# EAGLE design led_dual_supply_REV_2 (EAGLE 5.07)
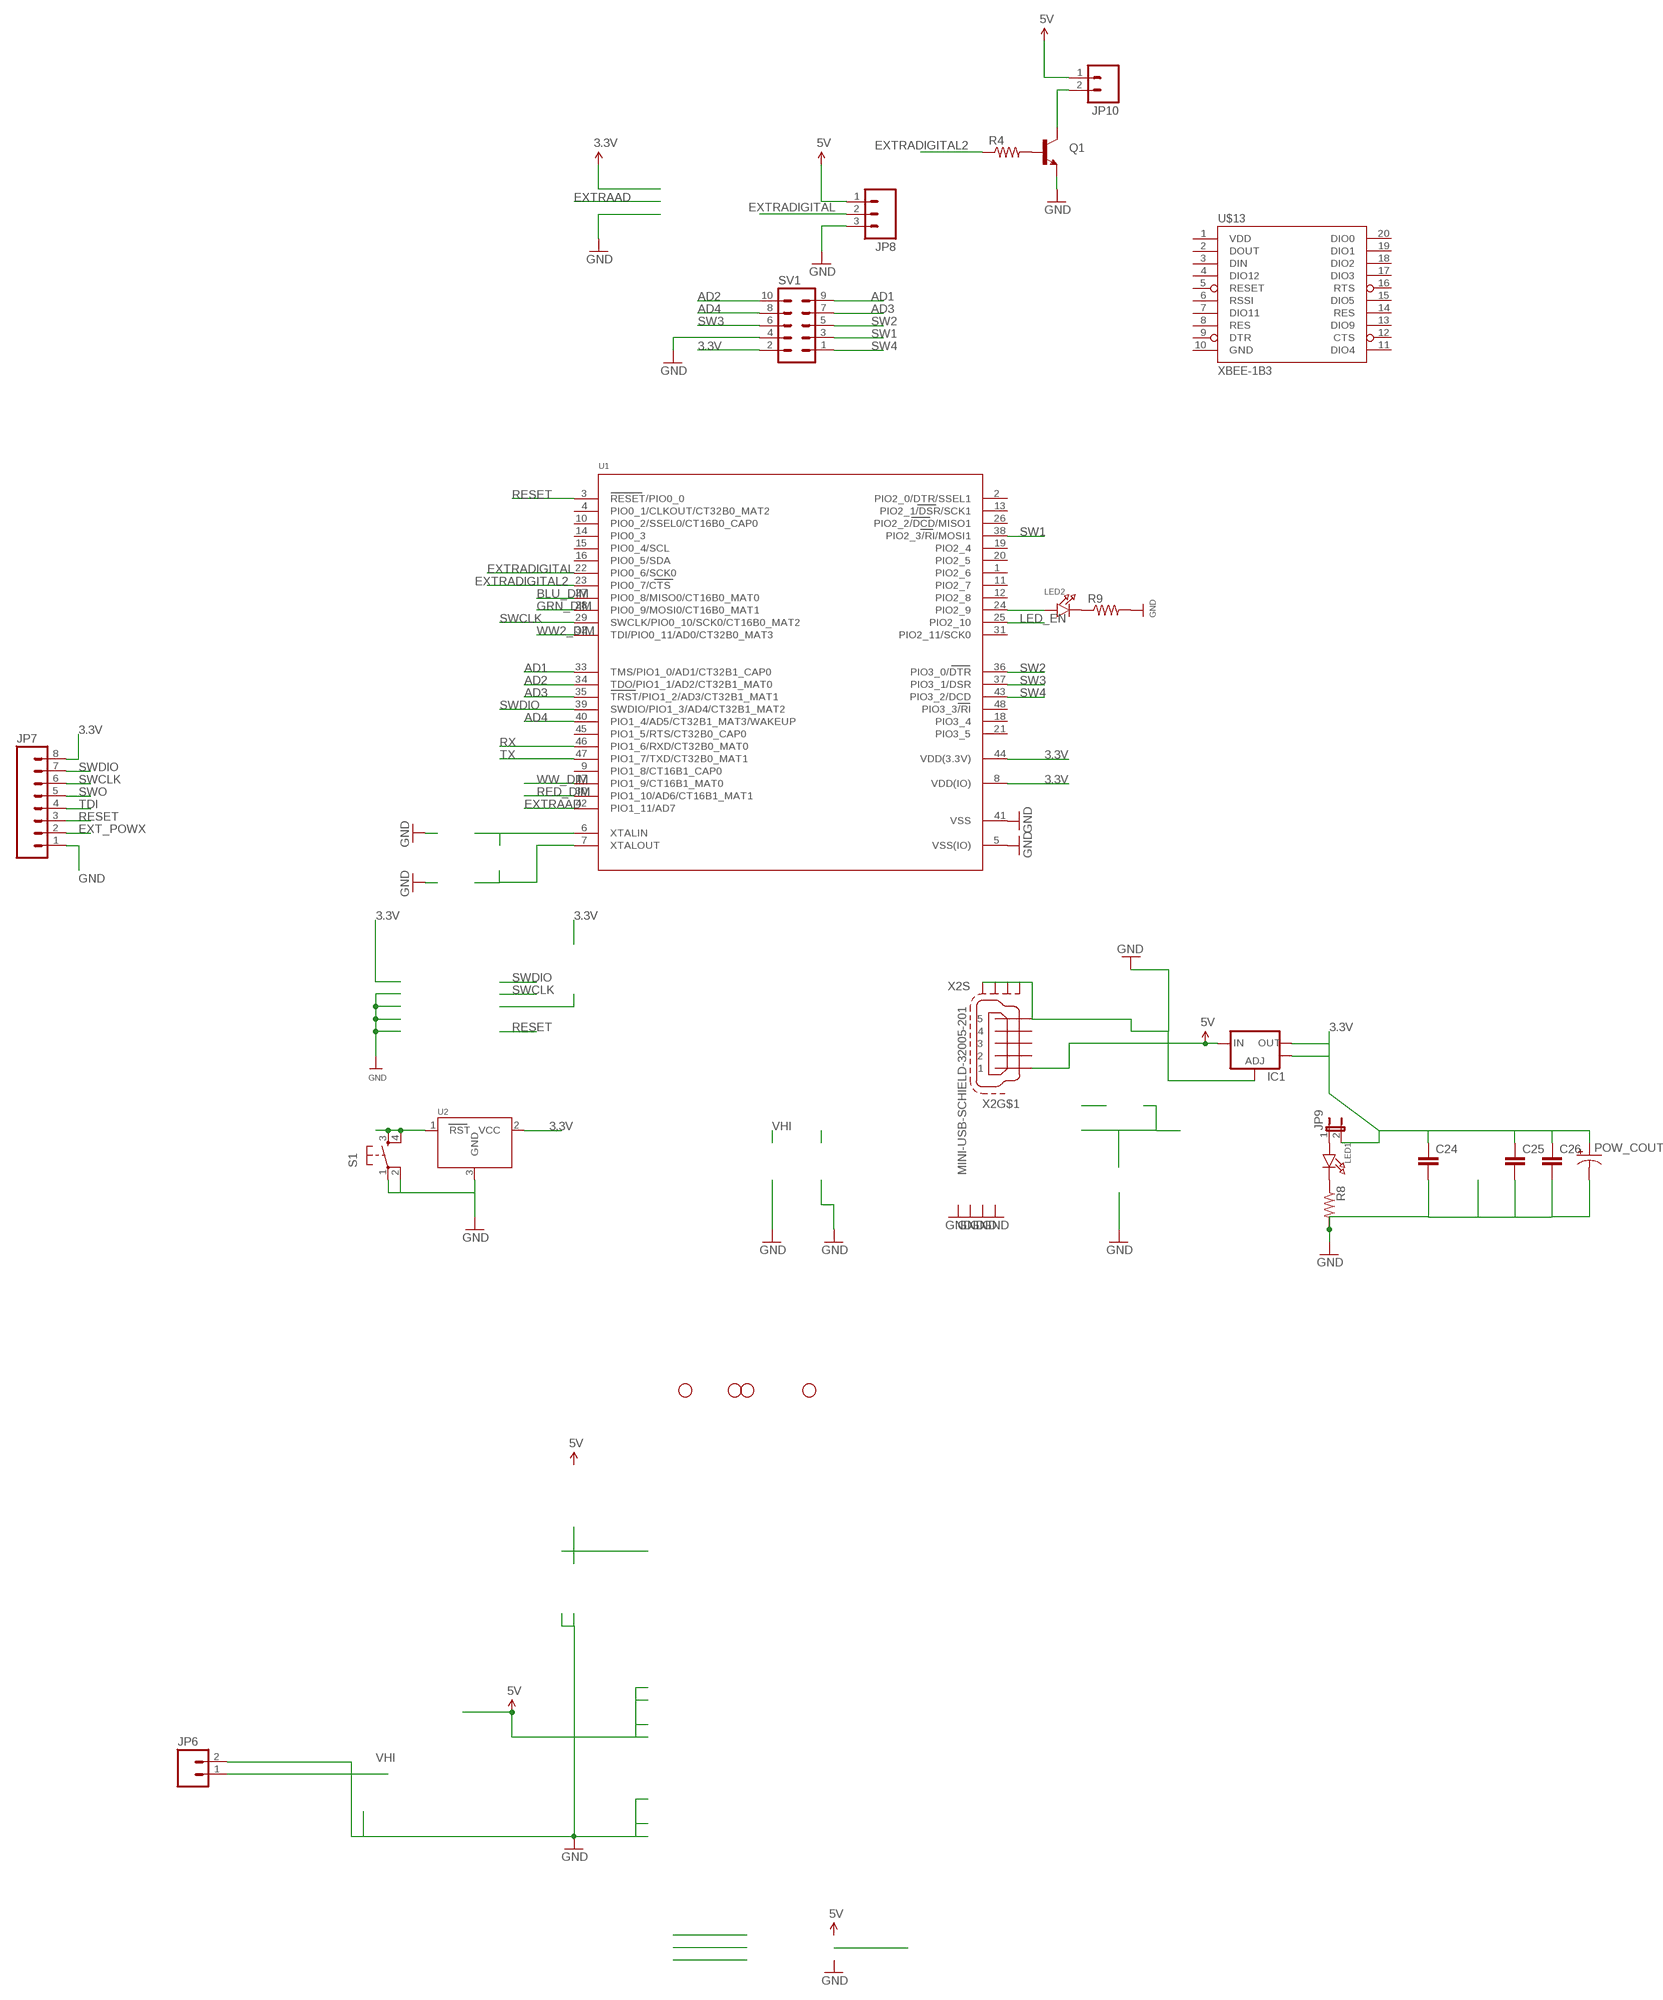
[diagram p0: schematic, sheet 1, part 1 of 2]
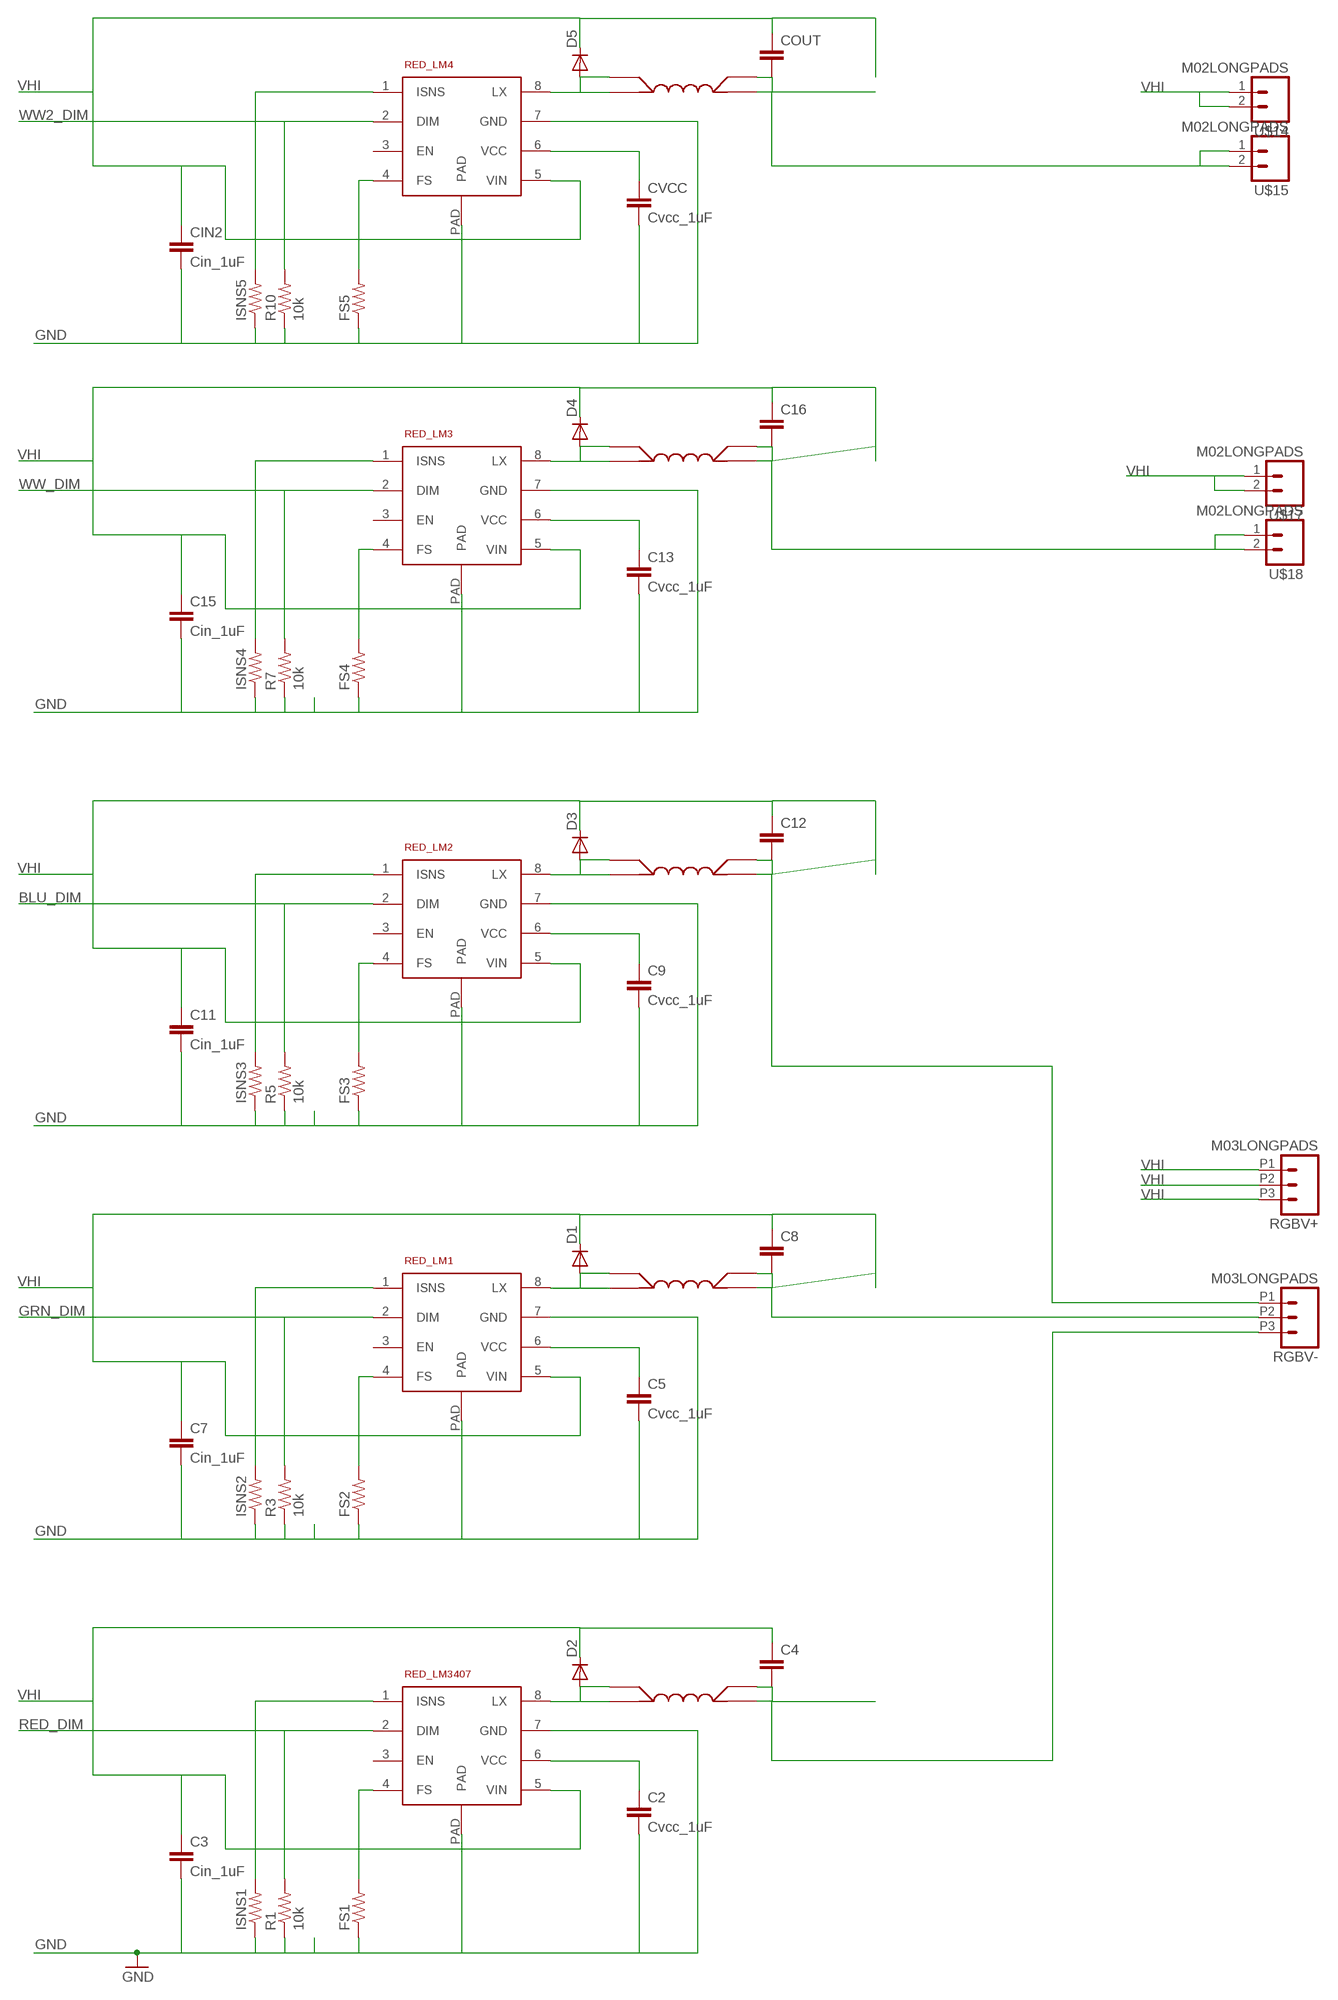
[diagram p1: schematic, sheet 1, part 2 of 2]

## Parts
C2  Cvcc_1uF  C-EUC1206  [C1206]
C3  Cin_1uF  C-EUC1206  [C1206]
C4  C-EUC1206  [C1206]
C5  Cvcc_1uF  C-EUC1206  [C1206]
C7  Cin_1uF  C-EUC1206  [C1206]
C8  C-EUC1206  [C1206]
C9  Cvcc_1uF  C-EUC1206  [C1206]
C11  Cin_1uF  C-EUC1206  [C1206]
C12  C-EUC1206  [C1206]
C13  Cvcc_1uF  C-EUC1206  [C1206]
C15  Cin_1uF  C-EUC1206  [C1206]
C16  C-EUC1206  [C1206]
C24  CAP0805  [0805]
C25  CAP0805  [0805]
C26  CAP0805  [0805]
CIN2  Cin_1uF  C-EUC1206  [C1206]
COUT  C-EUC1206  [C1206]
CVCC  Cvcc_1uF  C-EUC1206  [C1206]
D1  DIODESMA  [SMA-DIODE]
D2  DIODESMA  [SMA-DIODE]
D3  DIODESMA  [SMA-DIODE]
D4  DIODESMA  [SMA-DIODE]
D5  DIODESMA  [SMA-DIODE]
FS1  RESISTOR  [0805]
FS2  RESISTOR  [0805]
FS3  RESISTOR  [0805]
FS4  RESISTOR  [0805]
FS5  RESISTOR  [0805]
IC1  V_REG_LM1117SOT223  [SOT223]
ISNS1  RESISTOR  [0805]
ISNS2  RESISTOR  [0805]
ISNS3  RESISTOR  [0805]
ISNS4  RESISTOR  [0805]
ISNS5  RESISTOR  [0805]
JP2  STAND-OFF  [STAND-OFF]
JP3  STAND-OFF  [STAND-OFF]
JP4  STAND-OFF  [STAND-OFF]
JP5  STAND-OFF  [STAND-OFF]
JP6  M02  [1X02_LONGPADS]
JP7  M08  [1X08]
JP8  M03LOCK_LONGPADS  [1X03_LOCK_LONGPADS]
JP9  JUMPER-2SMD-NC  [SJ_2S]
JP10  M02LOCK  [1X02_LOCK]
LED1  LED0805  [CHIPLED_0805]
LED2  LED0805  [CHIPLED_0805]
POW_COUT  CAP_POL7343  [EIA7343]
Q1  TRANSISTOR_NPNSOT23-3  [SOT23-3]
R1  10k  RESISTOR  [0805]
R3  10k  RESISTOR  [0805]
R4  RESISTOR  [0805]
R5  10k  RESISTOR  [0805]
R7  10k  RESISTOR  [0805]
R8  RESISTOR  [0805]
R9  RESISTOR  [0805]
R10  10k  RESISTOR  [0805]
RED_LM1  LM3407  [LM3407]
RED_LM2  LM3407  [LM3407]
RED_LM3  LM3407  [LM3407]
RED_LM4  LM3407  [LM3407]
RED_LM3407  LM3407  [LM3407]
RGBV+  M03LONGPADS  [A19430-ELON]
RGBV-  M03LONGPADS  [A19430-ELON]
S1  TAC_SWITCHPTH  [TACTILE-PTH]
SV1  ML10  [ML10]
U1  LPC1113/4  [LQFP48]
U2  MCP130TREFLOW  [SOT23-R]
U$1  SRR4018  [SDR0805]
U$2  SRR4018  [SDR0805]
U$3  SRR4018  [SDR0805]
U$4  SRR4018  [SDR0805]
U$11  SRR4018  [SDR0805]
U$13  XBEE-1B3  [XBEE-SMD]
U$14  M02LONGPADS  [A19423-ELON]
U$15  M02LONGPADS  [A19423-ELON]
U$17  M02LONGPADS  [A19423-ELON]
U$18  M02LONGPADS  [A19423-ELON]
X2  MINI-USB-SCHIELD-32005-201  [32005-201]

## Nets
3.3V: C24.1 C25.1 C26.1 IC1.2(OUT) IC1.4(OUT) JP7.8 JP9.2 POW_COUT.A(+) SV1.2 U1.8(VDD(IO)) U1.44(VDD(3.3V)) U2.2(VCC) ; supply symbol labelled 5V
5V: IC1.3(IN) JP8.1 JP10.1 X2.1
AD1: SV1.9 U1.33(TMS/PIO1_0/AD1/CT32B1_CAP0)
AD2: SV1.10 U1.34(TDO/PIO1_1/AD2/CT32B1_MAT0)
AD3: SV1.7 U1.35(TRST/PIO1_2/AD3/CT32B1_MAT1)
AD4: SV1.8 U1.40(PIO1_4/AD5/CT32B1_MAT3/WAKEUP)
BLU_DIM: R5.2 RED_LM2.2(DIM) U1.27(PIO0_8/MISO0/CT16B0_MAT0)
EXT_POWX: JP7.2
EXTRAAD: U1.42(PIO1_11/AD7)
EXTRADIGITAL: JP8.2 U1.22(PIO0_6/SCK0)
EXTRADIGITAL2: R4.1 U1.23(PIO0_7/CTS)
GND: C2.2 C3.2 C5.2 C7.2 C9.2 C11.2 C13.2 C15.2 C24.2 C25.2 C26.2 CIN2.2 CVCC.2 FS1.1 FS2.1 FS3.1 FS4.1 FS5.1 IC1.1(ADJ) ISNS1.1 ISNS2.1 ISNS3.1 ISNS4.1 ISNS5.1 JP6.2 JP7.1 JP8.3 POW_COUT.C(-) Q1.2(E) R1.1 R3.1 R5.1 R7.1 R8.2 R9.2 R10.1 RED_LM1.7(GND) RED_LM1.PAD RED_LM2.7(GND) RED_LM2.PAD RED_LM3.7(GND) RED_LM3.PAD RED_LM4.7(GND) RED_LM4.PAD RED_LM3407.7(GND) RED_LM3407.PAD S1.1 S1.2 SV1.4 U1.5(VSS(IO)) U1.41(VSS) U2.3(GND) X2.5 X2.M1(S:S1) X2.M2(S:S2) X2.M3(S:S3) X2.M4(S:S4)
GRN_DIM: R3.2 RED_LM1.2(DIM) U1.28(PIO0_9/MOSI0/CT16B0_MAT1)
LED_EN: U1.25(PIO2_10)
N$1: C5.1 RED_LM1.6(VCC)
N$2: FS2.2 RED_LM1.4(FS)
N$3: C2.1 RED_LM3407.6(VCC)
N$4: ISNS2.2 RED_LM1.1(ISNS)
N$5: FS1.2 RED_LM3407.4(FS)
N$6: ISNS1.2 RED_LM3407.1(ISNS)
N$7: D2.A RED_LM3407.8(LX) U$2.1A U$2.1B
N$8: D1.A RED_LM1.8(LX) U$1.1A U$1.1B
N$10: C8.2 RGBV-.P2 U$1.2A U$1.2B
N$11: C9.1 RED_LM2.6(VCC)
N$12: FS3.2 RED_LM2.4(FS)
N$13: ISNS3.2 RED_LM2.1(ISNS)
N$14: D3.A RED_LM2.8(LX) U$3.1A U$3.1B
N$15: C12.2 RGBV-.P1 U$3.2A U$3.2B
N$16: C13.1 RED_LM3.6(VCC)
N$17: FS4.2 RED_LM3.4(FS)
N$18: ISNS4.2 RED_LM3.1(ISNS)
N$19: D4.A RED_LM3.8(LX) U$4.1A U$4.1B
N$20: C16.2 U$4.2A U$4.2B U$18.1 U$18.2
N$21: LED1.C R8.1
N$23: LED2.A U1.24(PIO2_9)
N$24: LED2.C R9.1
N$26: CVCC.1 RED_LM4.6(VCC)
N$27: FS5.2 RED_LM4.4(FS)
N$28: ISNS5.2 RED_LM4.1(ISNS)
N$29: D5.A RED_LM4.8(LX) U$11.1A U$11.1B
N$30: JP9.1 LED1.A
N$31: Q1.1(B) R4.2
N$36: C4.2 RGBV-.P3 U$2.2A U$2.2B
N$37: U1.7(XTALOUT)
N$38: U1.6(XTALIN)
N$64: JP10.2 Q1.3(C)
N$322: COUT.2 U$11.2A U$11.2B U$15.1 U$15.2
RED_DIM: R1.2 RED_LM3407.2(DIM) U1.30(PIO1_10/AD6/CT16B1_MAT1)
RESET: JP7.3 S1.3 S1.4 U1.3(RESET/PIO0_0) U2.1(RST)
RX: U1.46(PIO1_6/RXD/CT32B0_MAT0)
SW1: SV1.3 U1.38(PIO2_3/RI/MOSI1)
SW2: SV1.5 U1.36(PIO3_0/DTR)
SW3: SV1.6 U1.37(PIO3_1/DSR)
SW4: SV1.1 U1.43(PIO3_2/DCD)
SWCLK: JP7.6 U1.29(SWCLK/PIO0_10/SCK0/CT16B0_MAT2)
SWDIO: JP7.7 U1.39(SWDIO/PIO1_3/AD4/CT32B1_MAT2)
SWO: JP7.5
TDI: JP7.4
TX: U1.47(PIO1_7/TXD/CT32B0_MAT1)
VHI: C3.1 C4.1 C7.1 C8.1 C11.1 C12.1 C15.1 C16.1 CIN2.1 COUT.1 D1.C D2.C D3.C D4.C D5.C JP6.1 RED_LM1.5(VIN) RED_LM2.5(VIN) RED_LM3.5(VIN) RED_LM4.5(VIN) RED_LM3407.5(VIN) RGBV+.P1 RGBV+.P2 RGBV+.P3 U$14.1 U$14.2 U$17.1 U$17.2
WW2_DIM: R10.2 RED_LM4.2(DIM) U1.32(TDI/PIO0_11/AD0/CT32B0_MAT3)
WW_DIM: R7.2 RED_LM3.2(DIM) U1.17(PIO1_9/CT16B1_MAT0)
Unconnected: RED_LM1.3(EN) RED_LM2.3(EN) RED_LM3.3(EN) RED_LM4.3(EN) RED_LM3407.3(EN) U1.1(PIO2_6) U1.2(PIO2_0/DTR/SSEL1) U1.4(PIO0_1/CLKOUT/CT32B0_MAT2) U1.9(PIO1_8/CT16B1_CAP0) U1.10(PIO0_2/SSEL0/CT16B0_CAP0) U1.11(PIO2_7) U1.12(PIO2_8) U1.13(PIO2_1/DSR/SCK1) U1.14(PIO0_3) U1.15(PIO0_4/SCL) U1.16(PIO0_5/SDA) U1.18(PIO3_4) U1.19(PIO2_4) U1.20(PIO2_5) U1.21(PIO3_5) U1.26(PIO2_2/DCD/MISO1) U1.31(PIO2_11/SCK0) U1.45(PIO1_5/RTS/CT32B0_CAP0) U1.48(PIO3_3/RI) U$13.2(DOUT) U$13.3(DIN) U$13.4(DIO12) U$13.5(RESET) U$13.6(RSSI) U$13.7(DIO11) U$13.8(RES) U$13.9(DTR) U$13.11(DIO4) U$13.12(CTS) U$13.13(DIO9) U$13.14(RES) U$13.15(DIO5) U$13.16(RTS) U$13.17(DIO3) U$13.18(DIO2) U$13.19(DIO1) U$13.20(DIO0) X2.2 X2.3 X2.4

## Power pins joined to a net without a drawn wire
GND: U$13.10(GND)
VDD: U$13.1(VDD)

## Library data of the parts
C2 C3 C5 C7 C9 C11 C13 C15 CIN2 CVCC = resistor:C-EU: CAPACITOR, European symbol
C4 C8 C12 C16 COUT = rcl:C-EU: CAPACITOR, European symbol
C24-C26 = SparkFun:CAP: Capacitor Standard 0603 ceramic capacitor, and 0.1" leaded capacitor.
D1-D5 = SparkFun:DIODE: Diode These are standard reverse protection diodes and small signal diodes. SMA package can handle up to about 1A. SOD-323 can handle about 200mA. What the SOD-323 package when ordering, there are some mfgs out there that are 5-pin packages.
FS1-FS5 ISNS1-ISNS5 R1 R3-R5 R7-R10 = SparkFun:RESISTOR: Resistor Basic schematic elements and footprints for 0603, 1206, and PTH 1/10th watt (small) resistors.
IC1 = SparkFun:V_REG_LM1117: Voltage Regulator LM1117 Standard adjustable voltage regulator but in SMD form. Spark Fun Electronics SKU : COM-00595
JP2-JP5 = SparkFun:STAND-OFF: Stand Off This is the mechanical footprint for a #4 phillips button head screw. Use the keepout ring to avoid running the screw head into surrounding components. SKU : PRT-00447
JP6 JP10 = SparkFun:M02: Header 2 Standard 2-pin 0.1" header. Use with straight break away headers (SKU : PRT-00116), right angle break away headers (PRT-00553), swiss pins (PRT-00743), machine pins (PRT-00117), and female headers (PRT-00115). Molex polarized connector foot print use with SKU : PRT-08233 with associated crimp pins and housings.
JP7 = SparkFun:M08: Header 8 Standard 8-pin 0.1" header. Use with straight break away headers (SKU : PRT-00116), right angle break away headers (PRT-00553), swiss pins (PRT-00743), machine pins (PRT-00117), and female headers (PRT-00115).
JP8 = SparkFun:M03: Header 3 Standard 3-pin 0.1" header. Use with straight break away headers (SKU : PRT-00116), right angle break away headers (PRT-00553), swiss pins (PRT-00743), machine pins (PRT-00117), and female headers (PRT-00115). Molex polarized connector foot print use with SKU : PRT-08232 with associated crimp pins and housings.
JP9 = SparkFun:JUMPER-2: Jumper Basic 0.1" spaced jumper. Use with breakaway headers.
LED1 LED2 = microbuilder:LED: LED 0603 - 0603 Surface Mount Package Green LED - Low Power (3.9mcd, 2ma, 1.7Vf) Orange LED - Low Power (9.8mcd, 2ma, 1.8Vf) Red LED - Low Power (5mcd, 2ma, 1.8Vf) Yellow LED - Low Power (7mcd, 2ma, 1.8Vf) 0805 - 0805 Surface Mount Package Red LED (104mcd, 20mA, Diffused) - LS R976 [Digikey: 475-1278-6-ND] Red LED (12mcd, 20mA, 2.0Vf, Clear) - APT2012EC [Digikey: 754-1128-1-ND] Green LED (15mcd, 20mA, 2.2Vf, Clear) - APT2012GC [Digikey: 754-1131-1-ND] White LED (160mcd, 20mA, 2.1Vf, Clear) - APT2012SECK [Digikey: 754-1130-1-ND] 1206 - 1206 Surface Mount Package Green LED (26mcd, 20mA, Diffused) - LG N971 [Digikey: 475-1407-6-ND] Red LED (15mcd, 20mA, Diffused) - LH N974 [Digikey: 475-1416-6-ND]
POW_COUT = SparkFun:CAP_POL: Capacitor Polarized These are standard SMD and PTH capacitors. Normally 10uF, 47uF, and 100uF in electrolytic and tantalum varieties. Always verify the external diameter of the through hole cap, it varies with capacity, voltage, and manufacturer. The EIA devices should be standard.
Q1 = SparkFun:TRANSISTOR_NPN: Transistor NPN BJT configuration in SOT23 package. MMBT2222 is the common NPN we use. Double check BCE configuration again layout.
RED_LM1-RED_LM4 RED_LM3407 = JoesCustom:LM3407
RGBV+ RGBV- = _Part Repository:M03: 3-pin headers
S1 = SparkFun:TAC_SWITCH: Momentary Switch Button commonly used for reset or general input. Spark Fun Electronics SKU : COM-00097
SV1 = con-harting-ml:ML10: HARTING
U1 = microbuilder:LPC1113/4: LPC1113/4 MCU QFP48 Package ARM Cortex M0, 50MHz Operation, 8 Channel 10-Bit ADC, 1²C, 2xSPI, UART, 2x16 Bit and 2x32 Bit Timers, Internal 12MHz Oscillator, 1.8-3.6V operation. Model Flash SRAM Part N°: Digikey # LPC1113 24KB 8KB LPC1113FBD48/301 TBD LPC1114 32KB 8KB LPC1114FBD48/301 TBD
U2 = microbuilder:MCP130T: MCP130T Voltage Supervisor (Active Low) Voltage supervisors will put the MCU in a reset state if the voltage drops below a pre-determined level. SOT23-R/SOT23-W: Voltage Supervisor - 3.15V Active Low Note: Use the "Reflow" footprint when working with solder paste, and the "Wave" footprint when soldering by hand with a soldering iron (the latter has larger pads that are easier to solder by hand). Digikey: MCP130T-315I/TTCT-ND
U$1-U$4 U$11 = JoesCustom:SRR4018
U$13 = SparkFun:XBEE-1
U$14 U$15 U$17 U$18 = _Part Repository:M02: 2-Position Headers
X2 = con-cypressindustries:MINI-USB-SCHIELD-: MINI USB-B Conector Source: www.cypressindustries.com

## Board
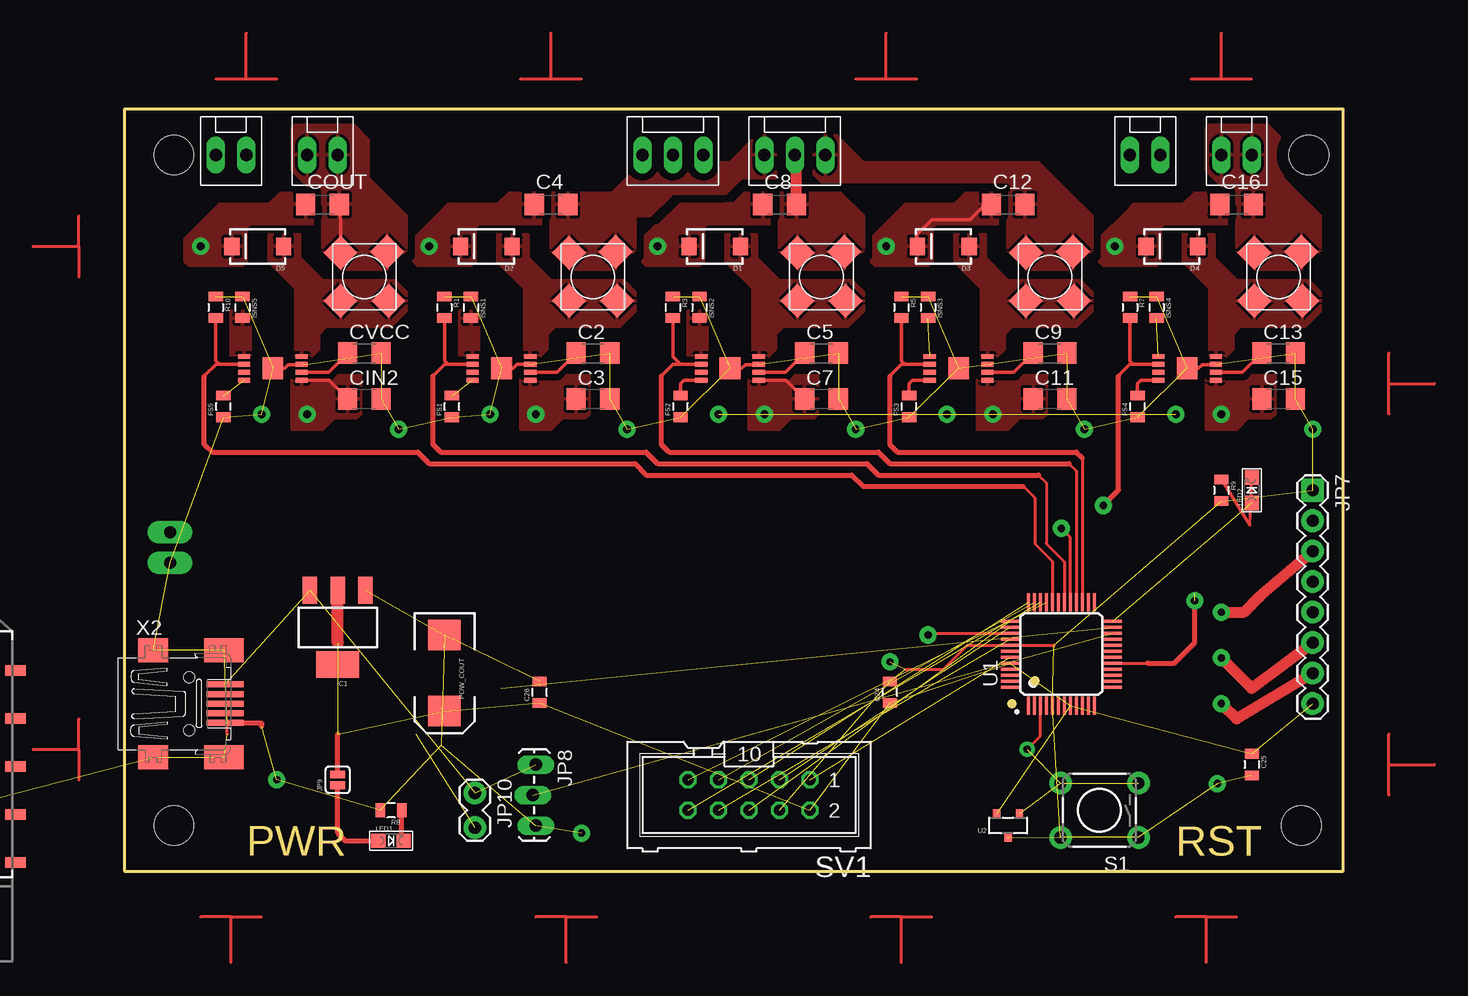
[diagram p2: board, top side]
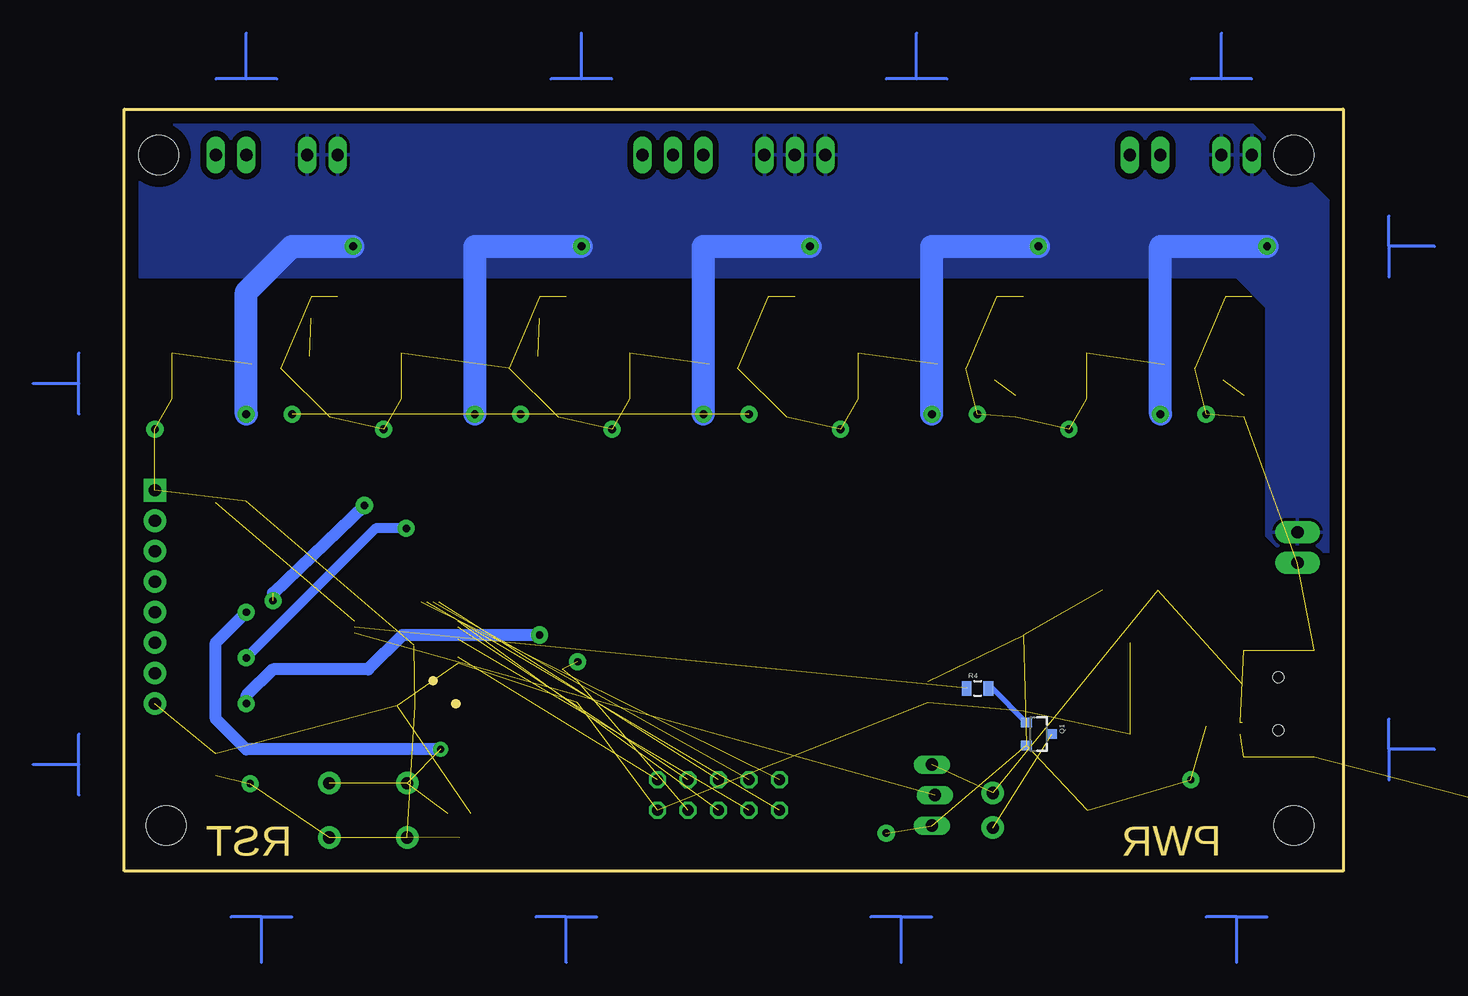
[diagram p3: board, bottom side, seen from below]

Size 101.6 x 63.5 mm. Coordinates in mm from the lower left corner, seen from the top.
Outline: 0,0 101.6,0 101.6,63.5 0,63.5 0,0
Copper layers (1*16): Top 0.035mm / dielectric 1.5mm / Bottom 0.035mm
Design rules "default *": minimum track width 9mil, minimum drill 24mil, track to track 9mil, track to pad 9mil, pad to pad 8mil, via to via 10mil, smd to smd 10mil, copper to edge 40mil, drill to drill 8mil, minimum pad ring 10mil, minimum via ring 8mil, stop-mask expansion 4mil, vias tented up to drill 0mil, thermal gap 10mil
tRestrict: 2 lines
bRestrict: 44 lines
Milling: area 75.7,15.7 to 76.1,16.1; area 73.8,13.8 to 74.2,14.1

### Footprints (pad centres in the part's own frame; a part is rotated, then mirrored left to right if it is on the bottom)
C1206 = smd 1.6 x 1.8: 1 -1.4,0; 2 1.4,0
0805 = smd 0.8 x 1.2: 1 -0.9,0; 2 0.9,0
SMA-DIODE = smd 1.27 x 1.47: A -2.15,0; C 2.15,0
SOT223 = smd 1.219 x 2.235: 1 -2.311,-3.099; 2 0,-3.099; 3 2.311,-3.099 | smd 3.6 x 2.2: 4 0,3.099
STAND-OFF = hole 3.302: 0,0
1X02_LONGPADS = drill 1.016 pad 1.88 long: 1 0,0; 2 2.54,0
1X08 = drill 1.016 pad 1.88 square: 1 0,0 | drill 1.016 pad 1.88 round: 2 2.54,0; 3 5.08,0; 4 7.62,0; 5 10.16,0; 6 12.7,0; 7 15.24,0; 8 17.78,0
1X03_LOCK_LONGPADS = drill 1.016 long: 1 0,0; 2 2.54,-0.254; 3 5.08,0
SJ_2S = smd 0.635 x 1.27: 1 -0.45,0; 2 0.45,0
1X02_LOCK = drill 1.016 pad 1.88 round: 1 -0.178,0; 2 2.718,0
CHIPLED_0805 = smd 1.2 x 1.2: A 0,-1.05; C 0,1.05
EIA7343 = smd 2.55 x 2.7: A 3.17,0; C -3.17,0
SOT23-3 = smd 0.8 x 0.9: 1 -0.95,-1; 2 0.95,-1; 3 0,1.1
LM3407 = smd 0.406 x 1.016: 1 -0.991,-2.4; 2 -0.33,-2.4; 3 0.33,-2.4; 4 0.991,-2.4; 5 0.991,2.4; 6 0.33,2.4; 7 -0.33,2.4; 8 -0.991,2.4 | smd 1.854 x 1.727: PAD 0,0
A19430-ELON = drill 1.02 long: P1 2.54,0; P2 0,0; P3 -2.54,0
TACTILE-PTH = drill 1.016 pad 1.88 round: 1 -3.251,2.261; 2 3.251,2.261; 3 -3.251,-2.261; 4 3.251,-2.261
ML10 = drill 0.914 octagon: 1 -5.08,-1.27; 2 -5.08,1.27; 3 -2.54,-1.27; 4 -2.54,1.27; 5 0,-1.27; 6 0,1.27; 7 2.54,-1.27; 8 2.54,1.27; 9 5.08,-1.27; 10 5.08,1.27
LQFP48 = smd 1.5 x 0.25: 1 -4.3,2.75; 2 -4.3,2.25; 3 -4.3,1.75; 4 -4.3,1.25; 5 -4.3,0.75; 6 -4.3,0.25; 7 -4.3,-0.25; 8 -4.3,-0.75; 9 -4.3,-1.25; 10 -4.3,-1.75; 11 -4.3,-2.25; 12 -4.3,-2.75; 25 4.3,-2.75; 26 4.3,-2.25; 27 4.3,-1.75; 28 4.3,-1.25; 29 4.3,-0.75; 30 4.3,-0.25; 31 4.3,0.25; 32 4.3,0.75; 33 4.3,1.25; 34 4.3,1.75; 35 4.3,2.25; 36 4.3,2.75 | smd 0.25 x 1.5: 13 -2.75,-4.3; 14 -2.25,-4.3; 15 -1.75,-4.3; 16 -1.25,-4.3; 17 -0.75,-4.3; 18 -0.25,-4.3; 19 0.25,-4.3; 20 0.75,-4.3; 21 1.25,-4.3; 22 1.75,-4.3; 23 2.25,-4.3; 24 2.75,-4.3; 37 2.75,4.3; 38 2.25,4.3; 39 1.75,4.3; 40 1.25,4.3; 41 0.75,4.3; 42 0.25,4.3; 43 -0.25,4.3; 44 -0.75,4.3; 45 -1.25,4.3; 46 -1.75,4.3; 47 -2.25,4.3; 48 -2.75,4.3
SOT23-R = smd 0.6 x 0.7: 1 -0.95,-1; 2 0.95,-1; 3 0,1
SDR0805 = smd 2 x 2 rotated 45: 1A -2,2; 1B 2,2; 2A -1.9,-2.1; 2B 2,-2
XBEE-SMD = smd 1.7 x 0.85: 1 -12.5,20; 2 -9.5,18; 3 -12.5,16; 4 -9.5,14; 5 -12.5,12; 6 -9.5,10; 7 -12.5,8; 8 -9.5,6; 9 -12.5,4; 10 -9.5,2; 11 12.5,2; 12 9.5,4; 13 12.5,6; 14 9.5,8; 15 12.5,10; 16 9.5,12; 17 12.5,14; 18 9.5,16; 19 12.5,18; 20 9.5,20
A19423-ELON = drill 1.02 long: 1 1.27,0; 2 -1.27,0
32005-201 = smd 3.1 x 0.5: 1 3,1.6; 2 3,0.8; 3 3,0; 4 3,-0.8; 5 3,-1.6 | smd 2.5 x 2: M1 -3,-4.45; M2 -3,4.45 | smd 3.3 x 2: M3 2.9,4.45; M4 2.9,-4.45 | hole 0.9: 0,2.2; 0,-2.2

### Placement (x,y rotation side)
C2  39.05,43.18 0 top
C3  39.05,39.37 0 top
C4  35.56,55.56 0 top
C5  58.1,43.18 0 top
C7  58.1,39.37 0 top
C8  54.61,55.56 0 top
C9  77.15,43.18 0 top
C11  77.15,39.37 0 top
C12  73.66,55.56 0 top
C13  96.2,43.18 0 top
C15  96.2,39.37 0 top
C16  92.71,55.56 0 top
C24  63.82,14.92 90 top
C25  93.98,8.89 270 top
C26  34.61,14.92 90 top
CIN2  20,39.37 0 top
COUT  16.51,55.56 0 top
CVCC  20,43.18 0 top
D1  49.21,52.07 180 top
D2  30.16,52.07 180 top
D3  68.26,52.07 180 top
D4  87.31,52.07 180 top
D5  11.11,52.07 180 top
FS1  27.3,38.73 90 top
FS2  46.35,38.73 90 top
FS3  65.41,38.73 90 top
FS4  84.45,38.73 90 top
FS5  8.26,38.73 90 top
IC1  17.78,20.32 180 top
ISNS1  28.89,46.99 270 top
ISNS2  47.94,46.99 270 top
ISNS3  66.99,46.99 270 top
ISNS4  86.04,46.99 270 top
ISNS5  9.84,46.99 270 top
JP2  98.11,3.81 0 bottom
JP3  4.13,59.69 0 bottom
JP4  4.13,3.81 0 bottom
JP5  98.74,59.69 0 top
JP6  3.81,28.26 270 bottom
JP7  99.06,31.75 270 top
JP8  34.29,8.89 270 top
JP9  17.78,7.62 90 top
JP10  29.21,6.35 270 top
LED1  22.23,2.54 270 top
LED2  93.98,31.75 0 top
POW_COUT  26.67,16.51 270 top
Q1  25.4,11.43 270 bottom
R1  26.67,46.99 270 top
R3  45.72,46.99 270 top
R4  30.48,15.24 0 bottom
R5  64.77,46.99 270 top
R7  83.82,46.99 270 top
R8  22.23,5.08 180 top
R9  91.44,31.75 270 top
R10  7.62,46.99 270 top
RED_LM1  50.48,41.91 270 top
RED_LM2  69.53,41.91 270 top
RED_LM3  88.58,41.91 270 top
RED_LM4  12.38,41.91 270 top
RED_LM3407  31.43,41.91 270 top
RGBV+  45.72,59.69 0 top
RGBV-  55.88,59.69 0 top
S1  81.28,5.08 180 top
SV1  52.07,6.35 180 top
U1  78.11,18.1 90 top
U2  73.66,3.81 180 top
U$1  58.1,49.53 180 top
U$2  39.05,49.53 180 top
U$3  77.15,49.53 180 top
U$4  96.2,49.53 180 top
U$11  20,49.53 180 top
U$13  -21.59,-1.27 0 top  (outside the outline)
U$14  8.89,59.69 0 top
U$15  16.51,59.69 0 top
U$17  85.09,59.69 0 top
U$18  92.71,59.69 0 top
X2  5.4,13.97 0 top

### Tracks (layer width: path | path; a pad name or v marks a point on that pad's centre or on a via)
3.3V  (11 unrouted)
  Top 0.406: JP9.2 17.78,11.43
  Top 1.016: 17.78,19.05 IC1.2
5V  (3 unrouted)
AD1  (1 unrouted)
AD2  (1 unrouted)
AD3  (1 unrouted)
AD4  (1 unrouted)
BLU_DIM
  Top 0.254: 79.86,34.45 U1.27
  Top 0.305: 65.08,42.24 64.77,42.55 R5.2 | 65.08,42.24 64.78,42.24 63.82,41.27 | 65.08,42.24 RED_LM2.2
  Top 0.406: 79.86,34.45 79.38,34.92 64.45,34.92 63.82,35.56 63.82,41.27
EXTRADIGITAL  (1 unrouted)
EXTRADIGITAL2  (1 unrouted)
GND  (via drill 0.61 pad 1.42, 0.66 pad 1.42)  (65 unrouted)
  Top 0.254: 65.09,16.83 68.26,16.83 70.28,18.85 U1.41 77.47,18.85 77.47,18.73 | 8.57,11.43 8.57,12.38
  Top 0.305: RED_LM4.PAD 13.34,41.91 13.65,42.23 14.8,42.23 | 14.8,42.23 14.92,42.23 | 14.8,42.23 RED_LM4.7 | RED_LM3407.PAD 32.38,41.91 32.72,42.24 RED_LM3407.7 | RED_LM1.PAD 51.44,41.91 51.75,42.23 52.87,42.23 RED_LM1.7 | RED_LM3.PAD 89.53,41.91 89.85,42.23 90.97,42.23 RED_LM3.7
  Top 0.406: 11.43,12.06 11.43,12.37 X2.5
  other vias: 91.12,7.3 38.1,3.17 63.82,17.46 12.7,7.62 30.48,38.1 11.43,38.1 22.86,36.83 41.91,36.83 60.96,36.83 80.01,36.83 99.06,36.83
GRN_DIM
  Top 0.254: U1.28 79.36,33.36 78.74,33.97
  Top 0.305: 46.34,42.24 45.72,42.86 R3.2 | 46.34,42.24 45.73,42.24 44.77,41.27 | 46.34,42.24 RED_LM1.2
  Top 0.406: 78.74,33.97 63.82,33.97 62.87,34.92 45.4,34.92 44.77,35.56 44.77,41.27
N$1
  Top 0.305: RED_LM1.6 55.1,41.58 C5.1
N$2
  Top 0.305: RED_LM1.4 46.63,40.92 46.35,40.64 FS2.2
N$3
  Top 0.305: RED_LM3407.6 36.05,41.58 C2.1
N$4
  pour Top (isolate 0.508): 48.58,42.86 48.58,46.67 46.99,46.67 46.99,42.86
N$5  (1 unrouted)
N$6
  pour Top (isolate 0.508): 29.53,42.86 29.53,46.67 27.94,46.67 27.94,42.86
N$7
  pour Top (isolate 0.508): 33.34,42.86 34.61,42.86 35.24,43.5 35.24,44.77 35.88,45.4 41.27,45.4 42.55,46.67 42.55,48.26 41.59,49.21 35.56,49.21 33.66,51.12 33.66,53.02 31.11,53.02 31.11,50.8 33.34,48.58
N$8
  pour Top (isolate 0.508): 52.39,42.86 53.66,42.86 54.29,43.5 54.29,44.77 54.93,45.4 60.33,45.4 61.59,46.67 61.59,48.26 60.64,49.21 54.61,49.21 52.7,51.12 52.7,53.02 50.16,53.02 50.16,50.8 52.39,48.58
N$10
  Top 0.914: C8.2 56.01,59.56 RGBV-.P2
  pour Top (isolate 0.61, rank 2): 54.61,56.52 54.61,51.75 56.2,50.16 60.01,50.16 61.59,51.75 61.59,54.61 59.69,56.52
N$11
  Top 0.305: RED_LM2.6 74.15,41.58 C9.1
N$12
  Top 0.305: RED_LM2.4 65.68,40.92 65.41,40.64 FS3.2
N$13  (1 unrouted)
N$14
  pour Top (isolate 0.508): 71.44,42.86 72.71,42.86 73.34,43.5 73.34,44.77 73.98,45.4 79.38,45.4 80.64,46.67 80.64,48.26 79.69,49.21 73.66,49.21 71.75,51.12 71.75,53.02 69.22,53.02 69.22,50.8 71.44,48.58
N$15
  pour Top (isolate 0.61, rank 2): 73.66,56.52 73.66,51.75 75.25,50.16 79.06,50.16 80.64,51.75 80.64,54.61 78.74,56.52
  pour Top (isolate 0.61, rank 2): 73.98,54.61 73.98,57.15 73.66,57.47 58.1,57.47 57.47,58.1 57.47,60.96 57.78,61.28 59.37,61.28 59.69,60.96 61.59,59.05 76.2,59.05 78.74,56.52 78.74,54.61
N$16
  Top 0.305: RED_LM3.6 93.2,41.58 C13.1
N$17
  Top 0.305: RED_LM3.4 84.73,40.92 84.45,40.64 FS4.2
N$18  (1 unrouted)
N$19
  pour Top (isolate 0.508): 90.49,42.86 91.76,42.86 92.39,43.5 92.39,44.77 93.03,45.4 98.42,45.4 99.69,46.67 99.69,48.26 98.74,49.21 92.71,49.21 90.81,51.12 90.81,53.02 88.27,53.02 88.27,50.8 90.49,48.58
N$20
  pour Top (isolate 0.61, rank 2): 92.71,56.52 92.71,51.75 94.3,50.16 98.11,50.16 99.69,51.75 99.69,54.61 97.79,56.52
  pour Top (isolate 0.508): 92.71,55.56 92.71,56.83 92.39,57.15 91.44,57.15 90.17,58.42 90.17,61.91 90.49,62.23 95.25,62.23 96.52,60.96 96.52,57.78 97.79,56.52 97.79,55.56
N$21
  Top 0.406: R8.1 23.12,2.69 LED1.C
N$23  (1 unrouted)
N$24
  Top 0.254: R9.1 93.83,28.84 LED2.C
N$25  (via drill 0.66 pad 1.42)  (2 unrouted)
  other vias: 49.53,38.1 68.58,38.1 87.63,38.1
N$26
  Top 0.305: RED_LM4.6 17,41.58 CVCC.1
N$27  (1 unrouted)
N$28
  pour Top (isolate 0.508): 10.48,42.86 10.48,46.67 8.89,46.67 8.89,42.86
N$29
  pour Top (isolate 0.508): 14.29,42.86 15.56,42.86 16.19,43.5 16.19,44.77 16.83,45.4 22.23,45.4 23.5,46.67 23.5,48.26 22.54,49.21 16.51,49.21 14.61,51.12 14.61,53.02 12.06,53.02 12.06,50.8 14.29,48.58
N$30
  Top 0.406: LED1.A 18.41,2.54 17.78,3.17 JP9.1
N$31
  Bottom 0.406: R4.2 29.26,15.24 Q1.1
N$36
  pour Top (isolate 0.61, rank 2): 35.56,56.52 35.56,51.75 37.15,50.16 40.96,50.16 42.55,51.75 42.55,54.61 40.64,56.52
  pour Top (isolate 0.61, rank 2): 54.29,57.78 54.29,61.28 52.7,61.28 50.48,59.05 43.18,59.05 40.64,56.52 40.64,54.61 42.55,54.61 43.81,54.61 45.72,56.52 50.16,56.52 51.44,57.78
N$39
  Top 0.254: -7.62,52.07 -3.81,52.07 | -3.81,52.07 -3.81,54.61 | -3.81,52.07 -3.81,49.53
N$40
  Bottom 0.254: -7.62,52.07 -3.81,52.07 | -3.81,52.07 -3.81,49.53 | -3.81,52.07 -3.81,54.61
N$42
  Top 0.254: -7.62,10.16 -3.81,10.16 | -3.81,10.16 -3.81,12.7 | -3.81,10.16 -3.81,7.62
N$43
  Bottom 0.254: -7.62,10.16 -3.81,10.16 | -3.81,10.16 -3.81,7.62 | -3.81,10.16 -3.81,12.7
N$44
  Top 0.254: 8.89,-7.62 8.89,-3.81 | 8.89,-3.81 6.35,-3.81 | 8.89,-3.81 11.43,-3.81
N$45
  Bottom 0.254: 8.89,-7.62 8.89,-3.81 | 8.89,-3.81 11.43,-3.81 | 8.89,-3.81 6.35,-3.81
N$46
  Top 0.254: 36.83,-7.62 36.83,-3.81 | 36.83,-3.81 34.29,-3.81 | 36.83,-3.81 39.37,-3.81
N$47
  Bottom 0.254: 36.83,-7.62 36.83,-3.81 | 36.83,-3.81 39.37,-3.81 | 36.83,-3.81 34.29,-3.81
N$48
  Top 0.254: 64.77,-7.62 64.77,-3.81 | 64.77,-3.81 62.23,-3.81 | 64.77,-3.81 67.31,-3.81
N$49
  Bottom 0.254: 64.77,-7.62 64.77,-3.81 | 64.77,-3.81 67.31,-3.81 | 64.77,-3.81 62.23,-3.81
N$50
  Top 0.254: 90.17,-7.62 90.17,-3.81 | 90.17,-3.81 87.63,-3.81 | 90.17,-3.81 92.71,-3.81
N$51
  Bottom 0.254: 90.17,-7.62 90.17,-3.81 | 90.17,-3.81 92.71,-3.81 | 90.17,-3.81 87.63,-3.81
N$52
  Top 0.254: 105.41,8.89 109.22,8.89 | 105.41,6.35 105.41,8.89 | 105.41,8.89 105.41,11.43
N$53
  Bottom 0.254: 105.41,8.89 109.22,8.89 | 105.41,8.89 105.41,11.43 | 105.41,6.35 105.41,8.89
N$54
  Top 0.254: 105.41,40.64 109.22,40.64 | 105.41,38.1 105.41,40.64 | 105.41,40.64 105.41,43.18
N$55
  Bottom 0.254: 105.41,40.64 109.22,40.64 | 105.41,40.64 105.41,43.18 | 105.41,38.1 105.41,40.64
N$56
  Top 0.254: 91.44,66.04 91.44,69.85 | 91.44,66.04 93.98,66.04 | 88.9,66.04 91.44,66.04
N$57
  Bottom 0.254: 91.44,66.04 91.44,69.85 | 88.9,66.04 91.44,66.04 | 91.44,66.04 93.98,66.04
N$58
  Top 0.254: 63.5,66.04 63.5,69.85 | 63.5,66.04 66.04,66.04 | 60.96,66.04 63.5,66.04
N$59
  Bottom 0.254: 63.5,66.04 63.5,69.85 | 60.96,66.04 63.5,66.04 | 63.5,66.04 66.04,66.04
N$60
  Top 0.254: 35.56,66.04 35.56,69.85 | 35.56,66.04 38.1,66.04 | 33.02,66.04 35.56,66.04
N$61
  Bottom 0.254: 35.56,66.04 35.56,69.85 | 33.02,66.04 35.56,66.04 | 35.56,66.04 38.1,66.04
N$62
  Top 0.254: 10.16,66.04 10.16,69.85 | 10.16,66.04 12.7,66.04 | 7.62,66.04 10.16,66.04
N$63
  Bottom 0.254: 10.16,66.04 10.16,69.85 | 7.62,66.04 10.16,66.04 | 10.16,66.04 12.7,66.04
N$64  (1 unrouted)
N$322
  Top 0.305: U$11.2A 21.58,51.63 | U$11.2B 18,54.2 COUT.2 17.59,55.75 17.78,55.88
  pour Top (isolate 0.61, rank 2): 16.51,56.52 16.51,51.75 18.1,50.16 21.91,50.16 23.5,51.75 23.5,54.61 21.59,56.52
  pour Top (isolate 0.508, rank 2): 16.51,55.56 16.51,56.83 16.19,57.15 15.24,57.15 13.97,58.42 13.97,61.91 14.29,62.23 19.05,62.23 20.32,60.96 20.32,57.78 21.59,56.52 21.59,55.56
RED_DIM
  Top 0.254: U1.30 78.36,25.79 76.83,27.3 76.83,32.38 76.2,33.02
  Top 0.305: 26.98,42.24 RED_LM3407.2 | 26.98,42.24 26.67,42.55 R1.2 | 26.98,42.24 26.68,42.24 25.72,41.27
  Top 0.406: 76.2,33.02 62.87,33.02 61.91,33.97 44.45,33.97 43.5,34.92 26.35,34.92 25.72,35.56 25.72,41.27
RESET  (via drill 0.61 pad 1.27, 0.61 pad 1.42)  (3 unrouted)
  Top 0.254: U1.3 76.36,11.27 v75.25,10.16
  Top 0.914: JP7.3 94.61,22.86 93.34,21.59 v91.44,21.59
  Bottom 1.016: v91.44,21.59 93.98,19.05 93.98,12.7 91.44,10.16 v75.25,10.16
SW1  (1 unrouted)
SW2  (1 unrouted)
  Top 0.254: U1.36 75.36,22.43
SW3  (1 unrouted)
SW4  (1 unrouted)
SWCLK  (via drill 0.61 pad 1.42)
  Top 0.254: U1.29 78.86,27.82 v78.11,28.57
  Top 0.914: JP7.6 93.98,15.24 v91.44,17.78
  Bottom 0.813: v78.11,28.57 80.64,28.57 v91.44,17.78
SWDIO  (via drill 0.61 pad 1.42)
  Top 0.254: 67.31,19.68 v66.99,19.68 67.16,19.85 U1.39
  Top 0.914: JP7.7 92.71,12.7 v91.44,13.97
  Bottom 1.016: v66.99,19.68 78.42,19.68 81.28,16.83 89.22,16.83 91.44,14.61 v91.44,13.97
VHI  (via drill 0.66 pad 1.42)
  Top 0.305: RED_LM4.5 17.05,40.92 CIN2.1 | C12.1 71.75,55.56 70.48,54.29 67.31,54.29 66.04,53.02 66.04,52.14 D3.C | RED_LM1.5 55.15,40.92 C7.1
  Top 0.914: D5.C 8.89,52.14
  Bottom 1.905: v25.4,52.07 34.29,52.07 v34.29,38.1 | v53.34,38.1 53.34,52.07 v44.45,52.07 | v63.5,52.07 72.39,52.07 v72.39,38.1 | v82.55,52.07 87.63,52.07 91.44,48.26 v91.44,38.1 | v15.24,38.1 15.24,52.07 v6.35,52.07
  pour Top (isolate 0.61, rank 3): 54.29,53.98 48.58,53.98 48.26,53.66 48.26,50.8 47.94,50.48 43.5,50.48 43.18,50.8 43.18,52.7 45.4,54.93 46.04,55.56 50.16,55.56 51.12,56.52 54.29,56.52
  pour Top (isolate 0.61, rank 3): 73.34,53.98 67.63,53.98 67.31,53.66 67.31,50.8 66.99,50.48 62.55,50.48 62.23,50.8 62.23,52.7 64.45,54.93 65.09,55.56 69.22,55.56 70.17,56.52 73.34,56.52
  pour Top (isolate 0.61, rank 3): 35.24,53.98 29.53,53.98 29.21,53.66 29.21,50.8 28.89,50.48 24.45,50.48 24.13,50.8 24.13,52.7 26.35,54.93 26.99,55.56 31.11,55.56 32.07,56.52 35.24,56.52
  pour Top (isolate 0.61, rank 3): 16.19,53.98 10.48,53.98 10.16,53.66 10.16,50.8 9.84,50.48 5.4,50.48 5.08,50.8 5.08,52.7 7.94,55.56 12.06,55.56 13.02,56.52 16.19,56.52
  pour Top (isolate 0.508): 33.02,41.27 38.73,41.27 38.73,38.1 38.42,37.78 36.51,37.78 35.56,36.83 33.02,36.83
  pour Top (isolate 0.508): 71.12,41.27 76.83,41.27 76.83,38.1 76.52,37.78 74.61,37.78 73.66,36.83 71.12,36.83
  pour Top (isolate 0.61, rank 3): 92.39,53.98 86.68,53.98 86.36,53.66 86.36,50.8 86.04,50.48 81.6,50.48 81.28,50.8 81.28,52.7 83.5,54.93 84.14,55.56 88.27,55.56 89.22,56.52 92.39,56.52
  pour Top (isolate 0.508): 90.17,41.27 95.89,41.27 95.89,38.1 95.57,37.78 93.66,37.78 92.71,36.83 90.17,36.83
  pour Top (isolate 0.508): 52.07,41.27 57.78,41.27 57.78,38.1 57.47,37.78 55.56,37.78 54.61,36.83 52.07,36.83
  pour Bottom (isolate 0.508): 0,26.67 5.08,26.67 6.35,27.94 6.35,46.99 8.89,49.53 100.33,49.53 100.33,62.23 7.62,62.23 6.35,60.96 0,54.61
  pour Top (isolate 0.508): 13.97,41.27 19.68,41.27 19.68,38.1 19.37,37.78 17.46,37.78 16.51,36.83 13.97,36.83
WW2_DIM
  Top 0.254: U1.32 77.36,25.83 75.88,27.3 75.88,31.11 74.93,32.07
  Top 0.305: 7.92,42.24 7.62,42.55 R10.2 | 7.92,42.24 7.63,42.24 6.67,41.27 | 7.92,42.24 RED_LM4.2
  Top 0.406: 74.93,32.07 61.59,32.07 60.64,33.02 43.5,33.02 42.55,33.97 25.4,33.97 24.45,34.92 7.3,34.92 6.67,35.56 6.67,41.27
WW_DIM  (via drill 0.61 pad 1.42)  (1 unrouted)
  Top 0.254: U1.17 85.29,17.35
  Top 0.305: 84.12,42.24 83.82,42.55 R7.2 | 84.12,42.24 83.83,42.24 82.87,41.27 | 84.12,42.24 RED_LM3.2
  Top 0.406: 82.87,41.27 82.87,31.75 v81.6,30.48 | 85.29,17.35 87.52,17.35 89.22,19.05 v89.22,22.54
  Bottom 1.016: 89.22,23.18 v81.6,30.48

### Text on the board
Milling: PWR | RST